# EAGLE schematic sp6641b (EAGLE 7.7.0)
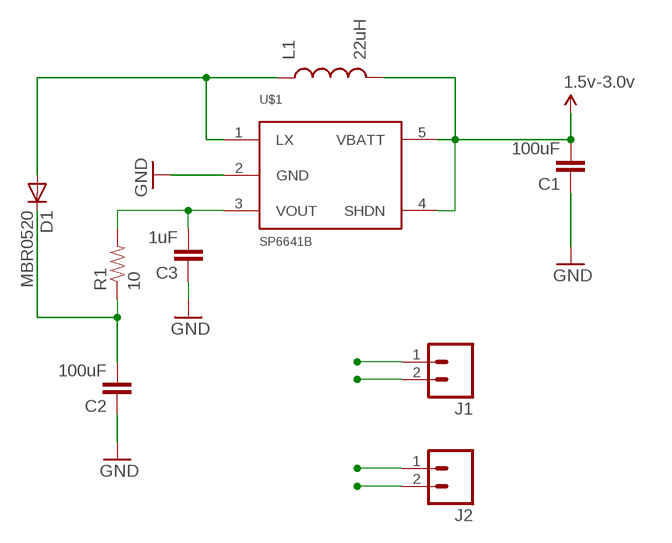
[diagram p0: schematic, sheet 1]

## Parts
C1  100uF  CAP0805  [0805]
C2  100uF  CAP0805  [0805]
C3  1uF  CAP0805  [0805]
D1  MBR0520  MBR0520LT  [SOD123]
J1  M02PTH  [1X02]
J2  M02PTH  [1X02]
L1  22uH  INDUCTORCR54  [CR54]
R1  10  0.3OHM-1/8W-1%(0805)  [0805]
U$1  SP6641B  SP6641SP6641A/B  [SOT23-5]

## Nets
GND: C1.1 C2.1 C3.1 J1.2 J2.2 U$1.2(GND)
N$1: C3.2 R1.2 U$1.3(VOUT)
N$3: D1.A L1.P$1 U$1.1(LX)
VBATT: C1.2 J1.1 L1.P$2 U$1.4(SHDN) U$1.5(VBATT) ; supply symbol labelled 1.5v-3.0v
VOUT: C2.2 D1.C J2.1 R1.1

## Library data of the parts
C1-C3 = SparkFun:CAP: Capacitor Standard 0603 ceramic capacitor, and 0.1" leaded capacitor.
D1 = diode:MBR0520LT: SCHOTTKY BARRIER RECTIFIER Source: http://onsemi.com .. MBR0520LT1-D.pdf
J1 J2 = SparkFun-Connectors:M02: Standard 2-pin 0.1" header. Use with - straight break away headers ( PRT-00116) - right angle break away headers (PRT-00553) - swiss pins (PRT-00743) - machine pins (PRT-00117) - female headers (PRT-00115) Molex polarized connector foot print use with: PRT-08233 with associated crimp pins and housings. 2.54_SCREWTERM for use with PRT-10571. 3.5mm Screw Terminal footprints for PRT-08084 5mm Screw Terminal footprints for use with PRT-08432
L1 = SparkFun:INDUCTOR: Inductors Basic Inductor/Choke - 0603 and 1206. Footprints are not proven and vary greatly between part numbers.
R1 = SparkFun-Resistors:0.3OHM-1/8W-1%(0805): RES-11622; PROD_ID: RES-11622; VALUE: 0.3
U$1 = Sipex Custom:SP6641